# Altium schematic sheet Power sheet.SchDoc: Power management
size A; DrawnBy: Mr.Farhad Jafari; Engineer: Mr.Farhad Jafari; Address1: www.BasetP.com; Address2: www.BasetP.com; Address3: www.BasetP.com; Address4: www.BasetP.com; Revision: V1.1; SheetNumber: 5; SheetTotal: 5; ProjectName: Adult humanoid robot
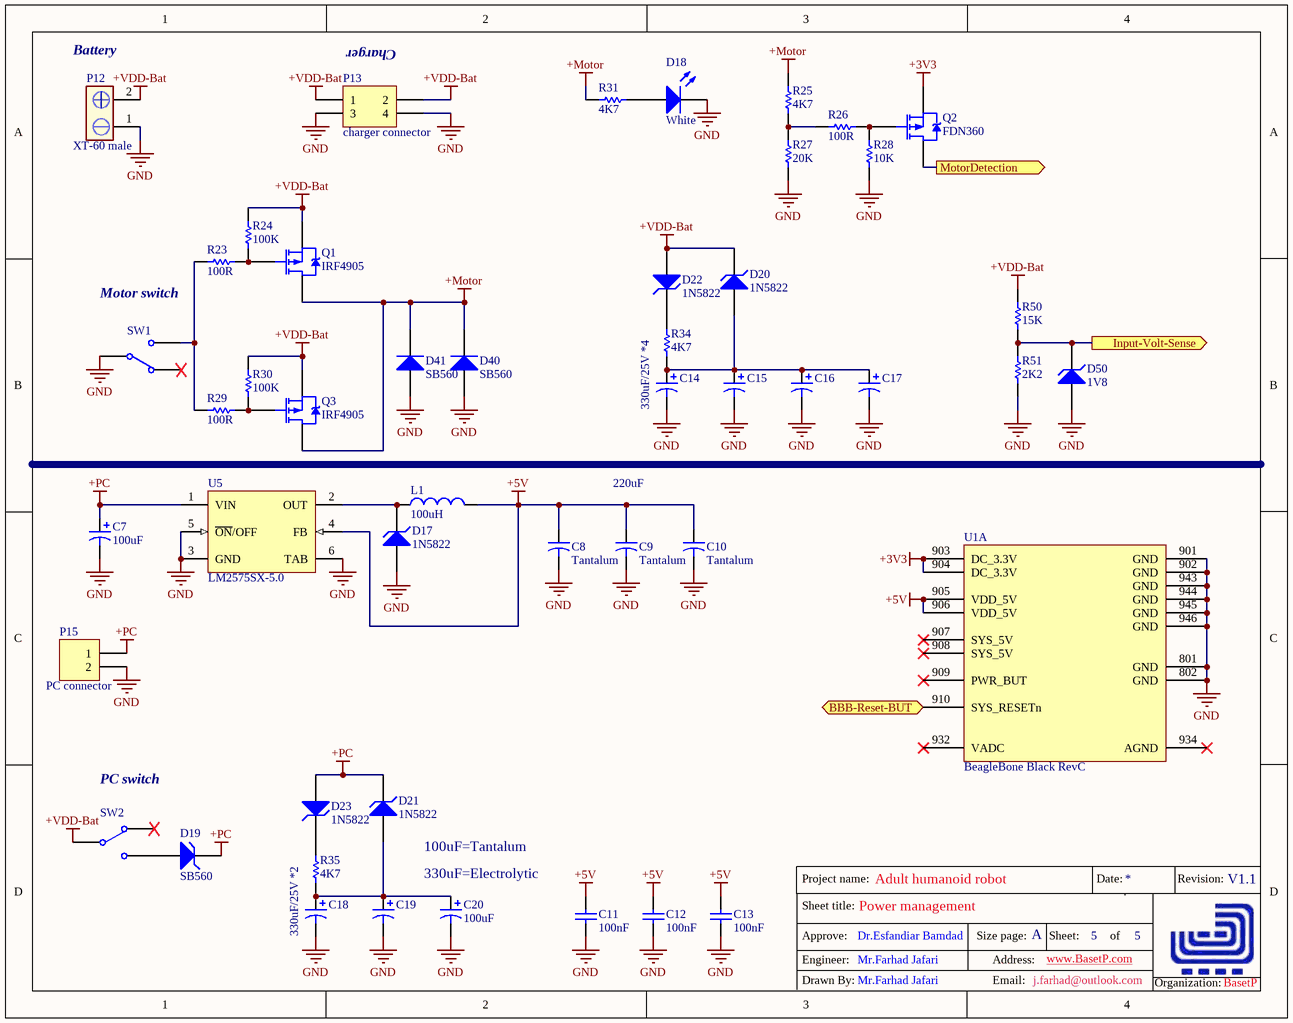
[diagram p0: Power sheet.SchDoc]

## Parts
C7  100uF  [B]
C8  Tantalum  [tantalum E]
C9  Tantalum  [tantalum E]
C10  Tantalum  [tantalum E]
C11  value 100nF  [0805]  (hidden comment: C0805)
C12  value 100nF  [0805]  (hidden comment: C0805)
C13  value 100nF  [0805]  (hidden comment: C0805)
C14  330uF/25V *4  [E']
C15  330uF/25V  [E']  (value not drawn)
C16  330uF/25V  [E']  (value not drawn)
C17  330uF/25V  [E']  (value not drawn)
C18  330uF/25V *2  [E']
C19  `  [E']  (value not drawn)
C20  100uF  [C5]
D17  1N5822  [DL-41]
D18  White  [LED Red-0805]
D19  SB560  [DL-41]
D20  1N5822  [MELF]
D21  1N5822  [MELF]
D22  1N5822  [MELF]
D23  1N5822  [MELF]
D40  SB560  [DO-41]
D41  SB560  [DO-41]
D50  1V8  [MELF]
L1  100uH  [inductor coil]
P12  XT-60 male  [XT-60 connector]
P13  charger connector  [connector 2*2]
P15  PC connector  [connector 1*2]
Q1  IRF4905  [TO-220AB]
Q2  FDN360  [SOT-23B_L]
Q3  IRF4905  [TO-220AB]
R23  100R  [6-0805]
R24  100K  [6-0805]
R25  4K7  [6-0805]
R26  100R  [6-0805]
R27  20K  [6-0805]
R28  10K  [6-0805]
R29  100R  [6-0805]
R30  100K  [6-0805]
R31  4K7  [6-0805]
R34  4K7  [8RB-1206]
R35  4K7  [8RB-1206]
R50  15K  [6-0805]
R51  2K2  [6-0805]
SW1  switch Red  [SW-power3A]  (value not drawn)
SW2  switch Red  [SW-power3A]  (value not drawn)
U1  BeagleBone Black RevC  [BBB-C]  (part A of 6)
U5  LM2575SX-5.0  [TS5B_N]

## Ports
BBB-Reset-BUT (in), Input-Volt-Sense (out), MotorDetection (out)

## Nets
+3V3: Q2.2(S) U1.903(DC_3.3V) U1.904(DC_3.3V)
+5V: C8.1 C9.1 C10.1 C11.2 C12.2 C13.2 L1.2 U1.905(VDD_5V) U1.906(VDD_5V) U5.4(FB)
+Motor: D40.2(K) D41.2(K) Q1.2(D) Q3.2(D) R25.2 R31.1
+PC: C7.1 D19.2(K) D21.2(K) D23.1(A) P15.1 U5.1(VIN)
+VDD-Bat: D20.2(K) D22.1(A) P12.2 P13.1 P13.2 Q1.3(S) Q3.3(S) R24.1 R30.2 R50.2 SW2.2(COMMON1)
GND: C7.2 C8.2 C9.2 C10.2 C11.1 C12.1 C13.1 C14.2 C15.2 C16.2 C17.2 C18.2 C19.2 C20.2 D17.1(A) D18.2(K) D40.1(A) D41.1(A) D50.1(A) P12.1 P13.3 P13.4 P15.2 R27.1 R28.1 R51.1 SW1.2(COMMON1) U1.801(GND) U1.802(GND) U1.901(GND) U1.902(GND) U1.943(GND) U1.944(GND) U1.945(GND) U1.946(GND) U5.3(GND) U5.5(~{ON}/OFF) U5.6(TAB)
BBB-Reset-BUT: U1.910(SYS_RESETn) ; port BBB-Reset-BUT
Input-Volt-Sense: D50.2(K) R50.1 R51.2 ; port Input-Volt-Sense
MotorDetection: Q2.3(D) ; port MotorDetection
NetC14_1: C14.1 C15.1 C16.1 C17.1 D20.1(A) R34.1
NetC18_1: C18.1 C19.1 C20.1 D21.1(A) R35.1
NetD17_2: D17.2(K) L1.1 U5.2(OUT)
NetD18_1: D18.1(A) R31.2
NetD19_1: D19.1(A) SW2.1(NO1)
NetD22_2: D22.2(K) R34.2
NetD23_2: D23.2(K) R35.2
NetQ1_1: Q1.1(G) R23.1 R24.2
NetQ2_1: Q2.1(G) R26.1 R28.2
NetQ3_1: Q3.1(G) R29.1 R30.1
NetR23_2: R23.2 R29.2 SW1.1(NO1)
NetR25_1: R25.1 R26.2 R27.2

Not connected (* = marked no-connect by the designer): U1 907(SYS_5V)* 908(SYS_5V)* 909(PWR_BUT)* 932(VADC)* 934(AGND)*

## Notes on the sheet
- (near P12) Battery
- (near P13) Charger
- Motor switch
- 220uF
- (near SW2) PC switch
- 100uF=Tantalum
- 330uF=Electrolytic
- Sheet title:
- Project name:
- Date:
- Revision:
- Engineer:
- Approve:
- Dr.Esfandiar Bamdad
- Size page:
- Address:
- A
- www.BasetP.com
- Sheet:
- of
- Drawn By:
- Mr.Farhad Jafari
- Email:
- j.farhad@outlook.com
- Organization:
- BasetP

## Library data of the parts
C7 = 100uF/25V: Solid Aluminum Capacitor with Organic Semiconductor Electrolyte: 10uF, 10V, Bulk Pack; Note: Part Numbers shown are for ± 20% capacitance tolerance (X0).; PCB_Layout: Complies with Manufacturer's Recommendation.; DrillSize: Nominal, Rounded to the nearest 0.1mm; Published: 19-Mar-2004; DatasheetDocument: 23-May-2001; PackageReference: B; Publisher: Altium Limited; ComponentLink1Description: Manufacturer Link; ComponentLink1URL: http://www.vishay.com/; ComponentLink2Description: Datasheet; ComponentLink2URL: http://www.vishay.com/docs/90004/94sc.pdf; Value: 10uF
C11-C13 = C0805: Ceramic Chip Capacitor - Standard; Note: Footprint corresponds to dimensions for bulk cassette packaging. This case size has tightened tolerances.; Published: 17-Jul-2002; LatestRevisionDate: 19-Mar-2004; LatestRevisionNote: Silkscreen size reduced.; DatasheetDocument: Mar-2001; PackageDocument: Mar-2001; PackageReference: 0805; Publisher: Altium Limited; Code_JEITA: 0805; Code_IPC: 2012[0805]; ComponentLink1Description: Manufacturer Link; ComponentLink1URL: http://www.kemet.com/; ComponentLink2Description: Datasheet; ComponentLink2URL: http://www.kemet.com/kemet/web/homepage/kechome.nsf/vapubfilesname/F3102TA.pdf/$file/F3102TA.pdf
C14-C19 = 330uF/25V: Solid Aluminum Capacitor with Organic Semiconductor Electrolyte: 100uF, 6.3V, Bulk Pack; Note: Part Numbers shown are for ± 20% capacitance tolerance (X0).; PCB_Layout: Complies with Manufacturer's Recommendation.; DrillSize: Nominal, Rounded to the nearest 0.1mm; Published: 19-Mar-2004; DatasheetDocument: 23-May-2001; PackageReference: E'; Publisher: Altium Limited; ComponentLink1Description: Manufacturer Link; ComponentLink1URL: http://www.vishay.com/; ComponentLink2Description: Datasheet; ComponentLink2URL: http://www.vishay.com/docs/90005/94sl.pdf; Value: 100uF
C20 = STC68-15C5RM: Subminiature, Leaded Solid Tantalum Capacitor: Radial-Lead, Polarised, 68uF, 20% Tolerance, 15 WVDC @ +85°C; Note: See Data Sheet for full range of components; Published: 19-Mar-2004; DatasheetDocument: 13-Jun-2002; PackageReference: C5; Publisher: Altium Limited; ComponentLink1Description: Manufacturer Link; ComponentLink1URL: http://www.vishay.com/; ComponentLink2Description: Datasheet; ComponentLink2URL: http://www.vishay.com/docs/43006/stc.pdf; Value: 68uF
D17 D19 = 1N5822: High-Voltage Power schottky Diode; Published: 8-Jun-2000; LatestRevisionDate: 19-Mar-2004; LatestRevisionNote: Silkscreen size reduced.; DatasheetDocument: 16-May-1997; PackageDocument: May-1997; PackageReference: MELF; Publisher: Altium Limited; ComponentLink1Description: Manufacturer Link; ComponentLink1URL: http://www.vishay.com/
D18 = LED-RED: High Performance Chip LED, Amber; LuminousIntensity: 25mcd (Minimum).; PCB_Layout: Complies with manufacturer's recommendation.; Published: 11-Dec-2002; PackageReference: 2.0X1.25X0.8; Publisher: Altium Limited; LED_Colour: Amber; ComponentLink1Description: Manufacturer Link; ComponentLink1URL: http://www.agilent.com/; ComponentLink2Description: Datasheet; ComponentLink2URL: http://cp.literature.agilent.com/litweb/pdf/5988-5891EN.pdf; DatasheetDocument: 11-Mar-2002; PackageDocument: 29-Oct-2001
D20-D23 D50 = ZMU100: High-Voltage Power Zener Diode; Published: 8-Jun-2000; LatestRevisionDate: 19-Mar-2004; LatestRevisionNote: Silkscreen size reduced.; DatasheetDocument: 16-May-1997; PackageDocument: May-1997; PackageReference: MELF; Publisher: Altium Limited; ComponentLink1Description: Manufacturer Link; ComponentLink1URL: http://www.vishay.com/
D40 D41 = Diode SB560: 1 Amp General Purpose Rectifier; Published: 8-Jun-2000; LatestRevisionDate: 17-Jul-2002; LatestRevisionNote: Re-released for DXP Platform.; DatasheetVersion: 1998; PackageVersion: Aug-1999; PackageReference: DO-41; Publisher: Altium Limited; PackageDescription: Diode, Axial; Body 5.2 x 2.7 mm (LxDia. max), Lead Dia. 0.86 mm (max); Code_JEDEC: DO-204-AL; ComponentLink1Description: Manufacturer Link; ComponentLink1URL: http://www.fairchildsemi.com/; ComponentLink2Description: Datasheet; ComponentLink2URL: http://www.fairchildsemi.com/ds/1N%2F1N4001.pdf
L1 = Inductor coil: Inductor coil  17mm * 9mm; Code_IEC: 1005; Published: 8-Jun-2000; LatestRevisionDate: 29-May-2009; LatestRevisionNote: IPC-7351 Footprint Added.; PackageReference: 0402-A; Publisher: Altium Limited; PackageDescription: Chip Inductor; Code_JEITA: 0402; Value: 100uH
P12 = XT-60 connector male: XT-60 connector male for battery
P13 = Header 2X2 right angle: Header, 4-Pin, 2X2 right angle; LatestRevisionDate: 17-Jul-2002; LatestRevisionNote: Re-released for DXP Platform.; Publisher: Altium Limited
P15 = Header 2 right angle: Header, 2-Pin right angle; LatestRevisionDate: 17-Jul-2002; LatestRevisionNote: Re-released for DXP Platform.; Publisher: Altium Limited
Q1 Q3 = IRF4905: HEXFET Power MOSFET; Note: Pin 2 is electrically connected to pin 4.; Published: 8-Jun-2000; LatestRevisionDate: 17-Jul-2002; LatestRevisionNote: Re-released for DXP Platform.; DatasheetVersion: Aug-1997; PackageVersion: Feb-1997; PackageReference: TO-220AB; Publisher: Altium Limited; PackageDescription: TO, Thru-Hole, Vertical, Heatsink Mounted; 3 In-Line Leads; Pitch 2.54 mm; ComponentLink1Description: Manufacturer Link; ComponentLink1URL: http://www.irf.com/; ComponentLink2Description: Datasheet; ComponentLink2URL: http://www.irf.com/product-info/datasheets/data/irf4905.pdf
Q2 = FDN360P: Mosfet
R23-R31 R50 R51 = ERJ6RS: Low Ohmic Value Thick Film Chip Resistor, 0.1 Ohm to 0.2 Ohm Range, 1%, 2% and 5% Tolerance, 0805 Size, 0.125 W; Published: 17-Dec-2003; LatestRevisionDate: 19-Mar-2004; LatestRevisionNote: Silkscreen size reduced.; PackageDocument: Mar-2003; PackageReference: 6-0805; Publisher: Altium Limited; Code_IPC: 2012 [0805]; ComponentLink1Description: Manufacturer Link; ComponentLink1URL: http://www.panasonic.com/industrial/components/resistive_products.htm; ComponentLink2Description: Datasheet; ComponentLink2URL: http://www.panasonic.com/industrial/components/pdf/AOA0000CE3.pdf
R34 R35 = ERJ8RS: Low Ohmic Value Thick Film Chip Resistor, 0.1 Ohm to 0.2 Ohm Range, 1%, 2% and 5% Tolerance, 1206 Size, 0.25 W; Published: 17-Dec-2003; LatestRevisionDate: 19-Mar-2004; LatestRevisionNote: Silkscreen size reduced.; PackageDocument: Mar-2003; PackageReference: 8RB-1206; Publisher: Altium Limited; Code_IPC: 3216 [1206]; ComponentLink1Description: Manufacturer Link; ComponentLink1URL: http://www.panasonic.com/industrial/components/resistive_products.htm; ComponentLink2Description: Datasheet; ComponentLink2URL: http://www.panasonic.com/industrial/components/pdf/AOA0000CE3.pdf
SW1 SW2 = switch Power: switch power black 3A/250VAC
U1 = BeagleBoneBlackRevC
U5 = LM2576SX-5.0: SIMPLE SWITCHER® 3A Step-Down Voltage Regulator, 5-pin TO-263; Manufacturer: National Semiconductor; PackageTopMarking: NSUZXYTTE#*LM2576S*-5.0 P+; PowerWise: N; Published: 1-Mar-2010; DatasheetVersion: Aug-2004; PackageVersion: revD, Apr-2005; PackageReference: TS5B; Publisher: Altium Limited; PackageDescription: TO-263, Molded, .400 x .390 x .180in, 5 Lead, .067in Pitch, Surface Mount; PartNumber: LM2576SX-5.0; RoHS: N; PinCount: 5; CompType: Switcher; Code_JEDEC: MO-169-AB; ComponentLink1Description: LM2576 Datasheet; ComponentLink1URL: http://www.national.com/ds/LM/LM2576.pdf; ComponentLink2Description: LM2576 Web Page; ComponentLink2URL: http://www.national.com/pf/LM/LM2576.html; ComponentLink3Description: TS5B Package Page; ComponentLink3URL: http://www.national.com/packaging/folders/ts5b.html